# EAGLE design Teensy_board (EAGLE 9.3.0)
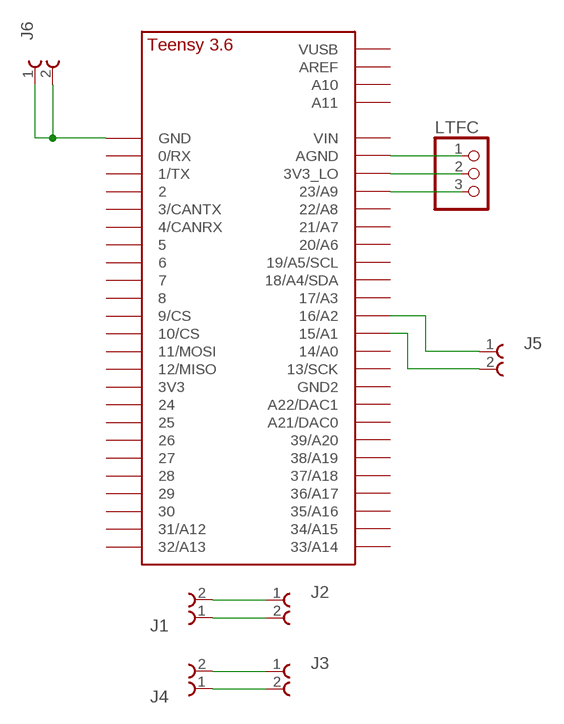
[diagram p0: schematic, sheet 1]

## Parts
J1  691103110002  [691103110002]
J2  691103110002  [691103110002]
J3  691103110002  [691103110002]
J4  691103110002  [691103110002]
J5  691103110002  [691103110002]
J6  691103110002  [691103110002]
LTFC  PINHD-1X3  [1X03]
U$1  TEENSY_3.5/3.6_BASIC  [TEENSY_3.5/3.6_BASIC]

## Nets
N$1: LTFC.1 U$1.AGND
N$2: LTFC.2 U$1.3V3_LO
N$3: LTFC.3 U$1.23/A9
N$4: J5.2 U$1.15/A1
N$5: J5.1 U$1.16/A2
N$6: J1.2 J2.1
N$7: J1.1 J2.2
N$8: J3.1 J4.2
N$9: J3.2 J4.1
SIGNAL_G: J6.1 J6.2 U$1.GND
Unconnected: U$1.0/RX U$1.1/TX U$1.2 U$1.3/CANTX U$1.3V3 U$1.4/CANRX U$1.5 U$1.6 U$1.7 U$1.8 U$1.9/CS U$1.10/CS U$1.11/MOSI U$1.12/MISO U$1.13/SCK U$1.14/A0 U$1.17/A3 U$1.18/A4/SDA U$1.19/A5/SCL U$1.20/A6 U$1.21/A7 U$1.21/DAC0(A21/DAC0) U$1.22/A8 U$1.24 U$1.25 U$1.26 U$1.27 U$1.28 U$1.29 U$1.30 U$1.31/A12 U$1.32/A13 U$1.33/A14 U$1.34/A15 U$1.35/A16 U$1.36/A17 U$1.37/A18 U$1.38/A19 U$1.39/A20 U$1.A10 U$1.A11 U$1.A22/DAC1 U$1.AREF U$1.GND2 U$1.VIN U$1.VUSB

## Library data of the parts
J1-J6 = Wurth_Elektronik_Electromechanic_Terminal_Blocks_Connectors_rev19a:691103110002: WR-TBL Serie 1031 - 3.5mm Horizontal Entry Modular with Pressure Clamp - 1.5mm2 Wires, 2 Pins=>Code : Con_TBL_Screw_PressureClamp_6911103110002 <http://katalog.we-online.de/media/images/eican/Con_TBL_Screw_PressureClamp_69111031100xx_pf2.jpg> Details see: http://katalog.we-online.de/en/em/691_103_110_0xx Created 2014-06-16, Karrer Zheng 2014 (C) Würth Elektronik
LTFC = pinhead:PINHD-1X3: PIN HEADER
U$1 = Teensy356:TEENSY_3.5/3.6_BASIC

## Board
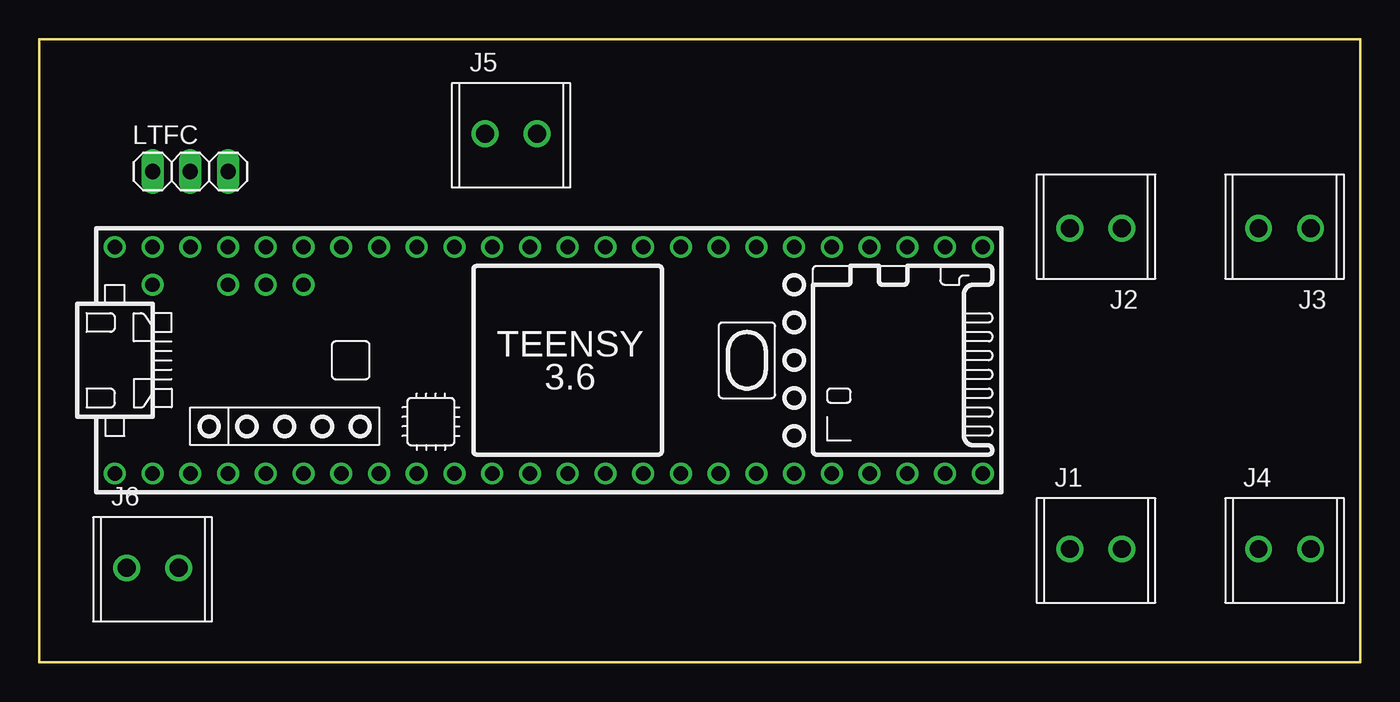
[diagram p1: board, top side]
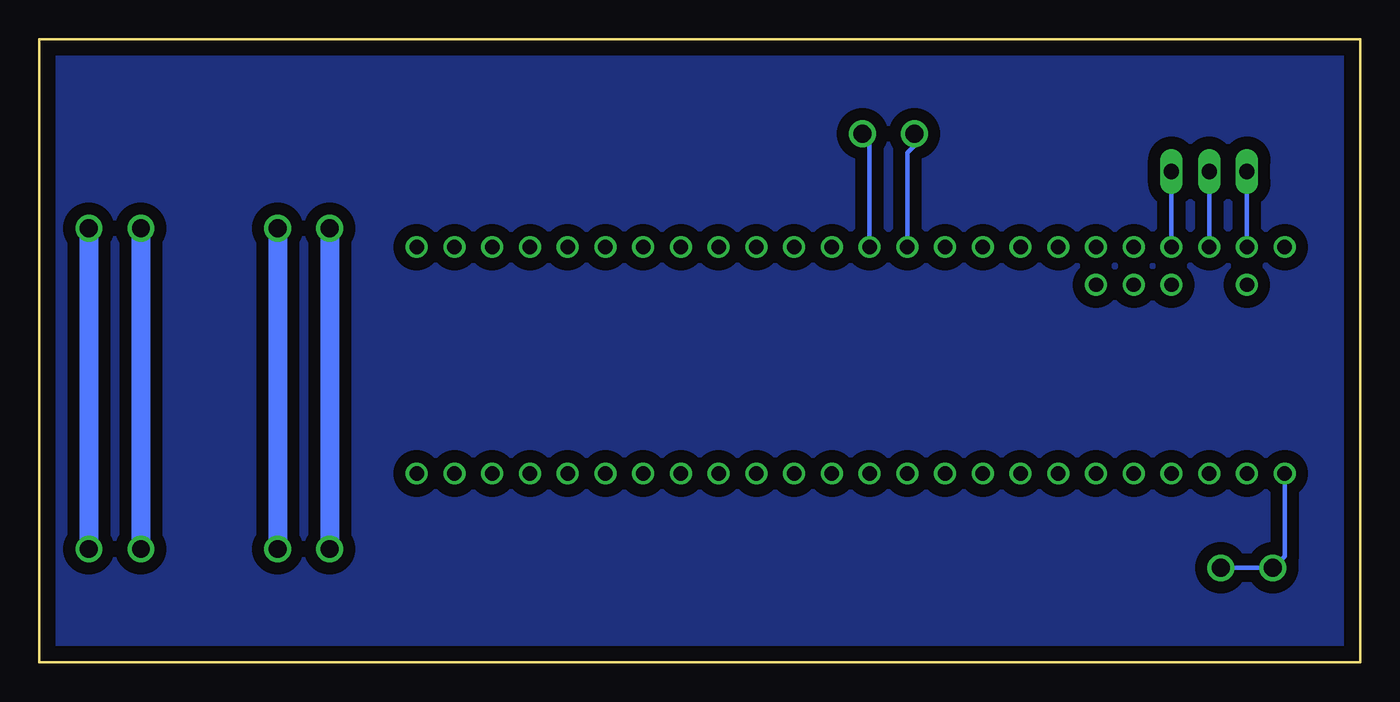
[diagram p2: board, bottom side, seen from below]

Size 88.9 x 41.91 mm. Coordinates in mm from the lower left corner, seen from the top.
Outline: 0,0 0,41.91 88.9,41.91 88.9,0 0,0
Copper layers (1*16): Top 0.035mm / dielectric 1.5mm / Bottom 0.035mm
Design rules "default": minimum track width 6mil, minimum drill 0.35mm, track to track 6mil, track to pad 6mil, pad to pad 6mil, via to via 6mil, smd to smd 6mil, copper to edge 40mil, drill to drill 6mil, minimum pad ring 10mil, minimum via ring 8mil, stop-mask expansion 4mil, vias tented up to drill 0mil, thermal gap 10mil

### Footprints (pad centres in the part's own frame; a part is rotated, then mirrored left to right if it is on the bottom)
691103110002 = drill 1.2: 1 -1.75,0; 2 1.75,0
1X03 = drill 1.016 long: 1 -2.54,0; 2 0,0; 3 2.54,0
TEENSY_3.5/3.6_BASIC = drill 0.965: 0/RX -25.4,-7.62; 1/TX -22.86,-7.62; 2 -20.32,-7.62; 3/CANTX -17.78,-7.62; 3V3 7.62,-7.62; 3V3_LO -22.86,7.62; 4/CANRX -15.24,-7.62; 5 -12.7,-7.62; 6 -10.16,-7.62; 7 -7.62,-7.62; 8 -5.08,-7.62; 9/CS -2.54,-7.62; 10/CS 0,-7.62; 11/MOSI 2.54,-7.62; 12/MISO 5.08,-7.62; 13/SCK 5.08,7.62; 14/A0 2.54,7.62; 15/A1 0,7.62; 16/A2 -2.54,7.62; 17/A3 -5.08,7.62; 18/A4/SDA -7.62,7.62; 19/A5/SCL -10.16,7.62; 20/A6 -12.7,7.62; 21/A7 -15.24,7.62; 21/DAC0 12.7,7.62; 22/A8 -17.78,7.62; 23/A9 -20.32,7.62; 24 10.16,-7.62; 25 12.7,-7.62; 26 15.24,-7.62; 27 17.78,-7.62; 28 20.32,-7.62; 29 22.86,-7.62; 30 25.4,-7.62; 31/A12 27.94,-7.62; 32/A13 30.48,-7.62; 33/A14 30.48,7.62; 34/A15 27.94,7.62; 35/A16 25.4,7.62; 36/A17 22.86,7.62; 37/A18 20.32,7.62; 38/A19 17.78,7.62; 39/A20 15.24,7.62; A10 -17.78,5.08; A11 -15.24,5.08; A22/DAC1 10.16,7.62; AGND -25.4,7.62; AREF -20.32,5.08; GND -27.94,-7.62; GND2 7.62,7.62; VIN -27.94,7.62; VUSB -25.4,5.08

### Placement (x,y rotation side)
J1  71.12,7.62 0 top
J2  71.12,29.21 180 top
J3  83.82,29.21 180 top
J4  83.82,7.62 0 top
J5  31.75,35.56 0 top
J6  7.62,6.35 0 top
LTFC  10.16,33.02 0 top
U$1  33.02,20.32 0 top

### Tracks (layer width: path | path; a pad name or v marks a point on that pad's centre or on a via)
N$1
  Bottom 0.305: LTFC.1 U$1.AGND
N$2
  Bottom 0.305: LTFC.2 U$1.3V3_LO
N$3
  Bottom 0.305: LTFC.3 U$1.23/A9
N$4
  Bottom 0.305: J5.2 33.02,35.08 U$1.15/A1
N$5
  Bottom 0.305: J5.1 30,34.77 30.48,34.29 U$1.16/A2
N$6
  Bottom 1.27: J2.1 J1.2
N$7
  Bottom 1.27: J2.2 J1.1
N$8
  Bottom 1.27: J3.1 J4.2
N$9
  Bottom 1.27: J3.2 J4.1
N$10
  Top 0.152: 0,0 0,41.91 88.9,41.91 88.9,0 0,0
POUR
  pour Bottom (isolate 0.813): 0,0 0,41.91 88.9,41.91 88.9,0
SIGNAL_G
  Bottom 0.305: U$1.GND 5.08,7.14 J6.1 J6.2